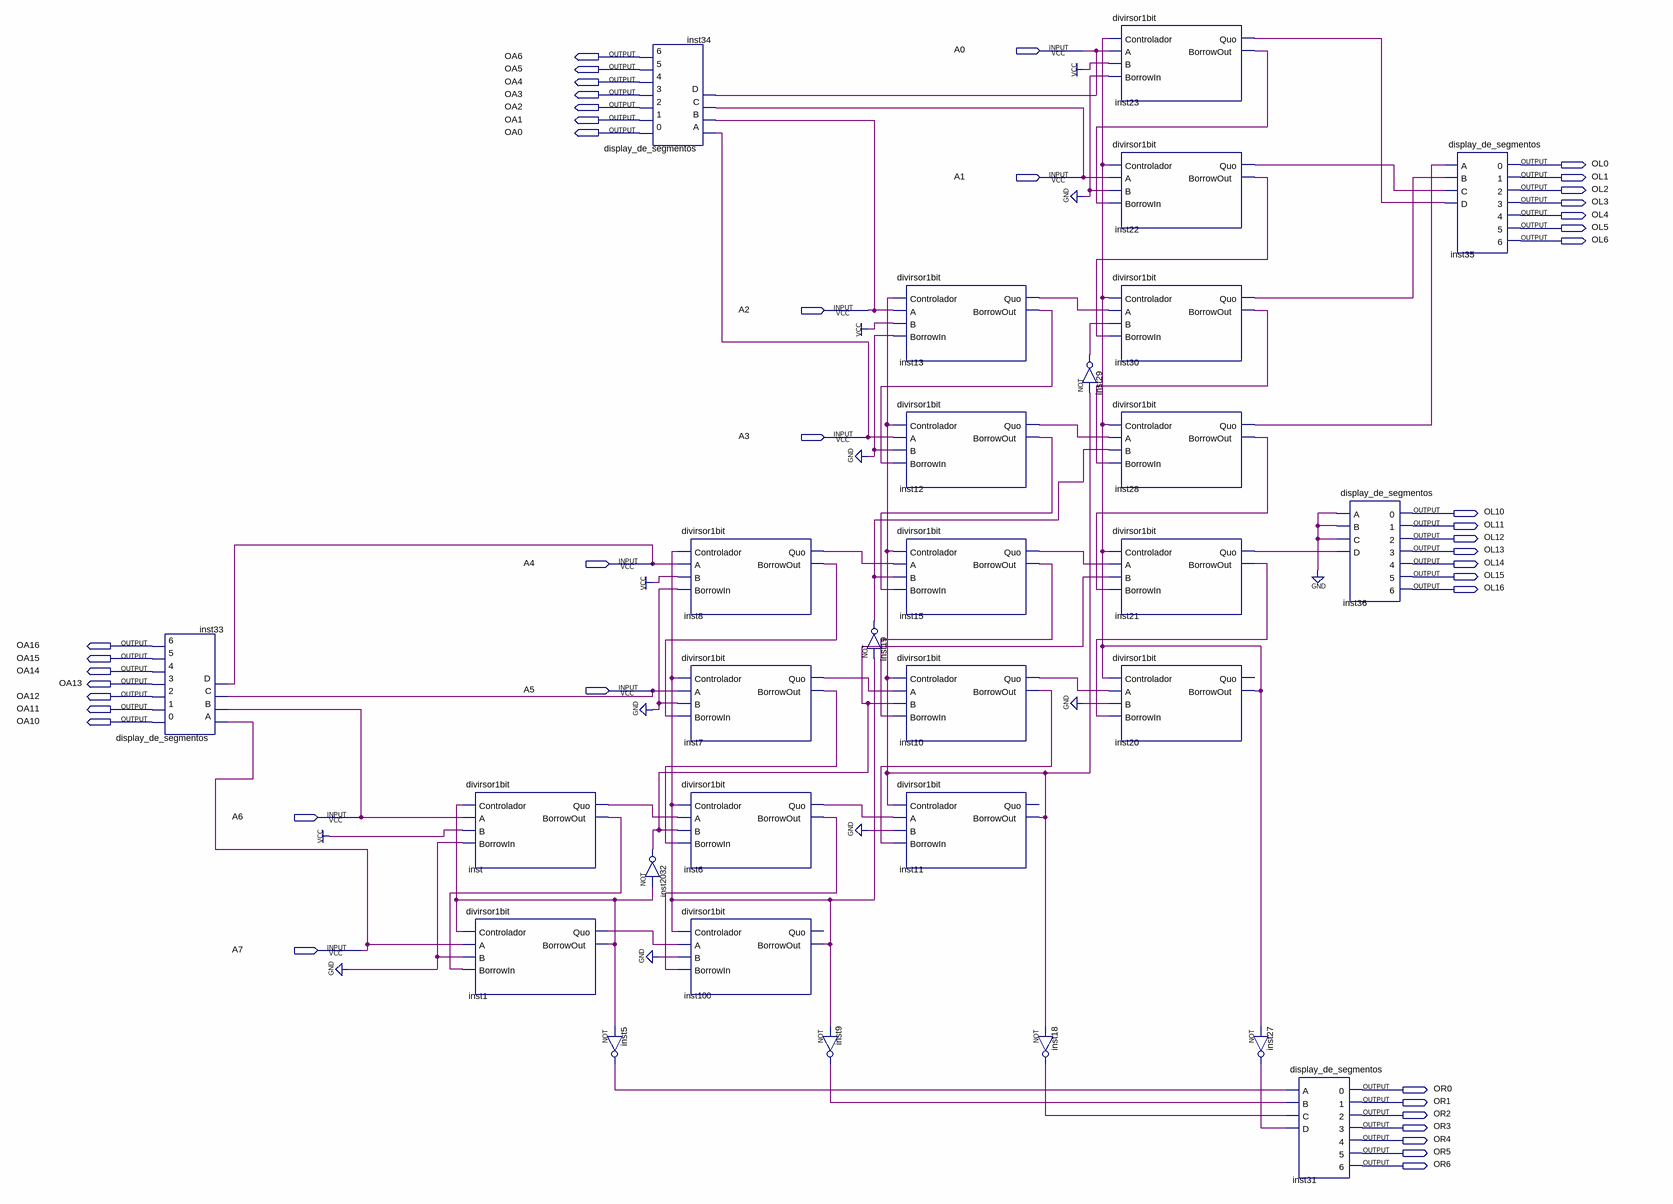
[diagram p0: schematic sheet]
// Quartus schematic raizQuadrada.bdf as structural Verilog: 29 symbols, 43 pins
module raizQuadrada (
  input  A0,
  input  A1,
  input  A2,
  input  A3,
  input  A4,
  input  A5,
  input  A6,
  input  A7,
  output OA6,
  output OA5,
  output OA4,
  output OA3,
  output OA2,
  output OA1,
  output OA0,
  output OL0,
  output OL1,
  output OL2,
  output OL3,
  output OL4,
  output OL5,
  output OL6,
  output OL10,
  output OL11,
  output OL12,
  output OL13,
  output OL14,
  output OL15,
  output OL16,
  output OA16,
  output OA15,
  output OA14,
  output OA13,
  output OA12,
  output OA11,
  output OA10,
  output OR0,
  output OR1,
  output OR2,
  output OR3,
  output OR4,
  output OR5,
  output OR6
);

  wire inst1_borrowout, inst1_quo, inst5_out, inst6_borrowout, inst6_quo, inst7_borrowout, inst7_quo,
       inst8_borrowout, inst8_quo, inst9_out, inst10_borrowout, inst10_quo, inst11_borrowout,
       inst12_borrowout, inst12_quo, inst13_borrowout, inst13_quo, inst15_borrowout, inst15_quo, inst18_out,
       inst19_out, inst20_borrowout, inst21_borrowout, inst21_quo, inst22_borrowout, inst22_quo,
       inst23_borrowout, inst23_quo, inst27_out, inst28_borrowout, inst28_quo, inst29_out, inst30_borrowout,
       inst30_quo, inst100_borrowout, inst2032_out, inst_borrowout, inst_quo;

  display_de_segmentos inst33 (
    .A(A7), .B(A6), .C(A5), .D(A4), .\0 (OA10), .\1 (OA11), .\2 (OA12), .\3 (OA13), .\4 (OA14), .\5 (OA15),
    .\6 (OA16));
  divirsor1bit inst (
    .Controlador(inst1_borrowout), .A(A6), .B(1'b1), .BorrowIn(1'b0), .Quo(inst_quo),
    .BorrowOut(inst_borrowout));
  divirsor1bit inst1 (
    .Controlador(inst1_borrowout), .A(A7), .B(1'b0), .BorrowIn(inst_borrowout), .Quo(inst1_quo),
    .BorrowOut(inst1_borrowout));
  not inst5 (inst5_out, inst1_borrowout);
  display_de_segmentos inst34 (
    .A(A3), .B(A2), .C(A1), .D(A0), .\0 (OA0), .\1 (OA1), .\2 (OA2), .\3 (OA3), .\4 (OA4), .\5 (OA5),
    .\6 (OA6));
  not inst2032 (inst2032_out, inst1_borrowout);
  divirsor1bit inst8 (
    .Controlador(inst100_borrowout), .A(A4), .B(1'b1), .BorrowIn(1'b0), .Quo(inst8_quo),
    .BorrowOut(inst8_borrowout));
  divirsor1bit inst7 (
    .Controlador(inst100_borrowout), .A(A5), .B(1'b0), .BorrowIn(inst8_borrowout), .Quo(inst7_quo),
    .BorrowOut(inst7_borrowout));
  divirsor1bit inst6 (
    .Controlador(inst100_borrowout), .A(inst_quo), .B(inst2032_out), .BorrowIn(inst7_borrowout),
    .Quo(inst6_quo), .BorrowOut(inst6_borrowout));
  divirsor1bit inst100 (
    .Controlador(inst100_borrowout), .A(inst1_quo), .B(1'b0), .BorrowIn(inst6_borrowout),
    .BorrowOut(inst100_borrowout));  // open: Quo
  not inst9 (inst9_out, inst100_borrowout);
  divirsor1bit inst13 (
    .Controlador(inst11_borrowout), .A(A2), .B(1'b1), .BorrowIn(1'b0), .Quo(inst13_quo),
    .BorrowOut(inst13_borrowout));
  divirsor1bit inst12 (
    .Controlador(inst11_borrowout), .A(A3), .B(1'b0), .BorrowIn(inst13_borrowout), .Quo(inst12_quo),
    .BorrowOut(inst12_borrowout));
  divirsor1bit inst15 (
    .Controlador(inst11_borrowout), .A(inst8_quo), .B(inst19_out), .BorrowIn(inst12_borrowout),
    .Quo(inst15_quo), .BorrowOut(inst15_borrowout));
  not inst19 (inst19_out, inst100_borrowout);
  divirsor1bit inst10 (
    .Controlador(inst11_borrowout), .A(inst7_quo), .B(inst2032_out), .BorrowIn(inst15_borrowout),
    .Quo(inst10_quo), .BorrowOut(inst10_borrowout));
  divirsor1bit inst11 (
    .Controlador(inst11_borrowout), .A(inst6_quo), .B(1'b0), .BorrowIn(inst10_borrowout),
    .BorrowOut(inst11_borrowout));  // open: Quo
  not inst18 (inst18_out, inst11_borrowout);
  divirsor1bit inst23 (
    .Controlador(inst20_borrowout), .A(A0), .B(1'b1), .BorrowIn(1'b0), .Quo(inst23_quo),
    .BorrowOut(inst23_borrowout));
  divirsor1bit inst22 (
    .Controlador(inst20_borrowout), .A(A1), .B(1'b0), .BorrowIn(inst23_borrowout), .Quo(inst22_quo),
    .BorrowOut(inst22_borrowout));
  divirsor1bit inst30 (
    .Controlador(inst20_borrowout), .A(inst13_quo), .B(inst29_out), .BorrowIn(inst22_borrowout),
    .Quo(inst30_quo), .BorrowOut(inst30_borrowout));
  not inst29 (inst29_out, inst11_borrowout);
  divirsor1bit inst28 (
    .Controlador(inst20_borrowout), .A(inst12_quo), .B(inst19_out), .BorrowIn(inst30_borrowout),
    .Quo(inst28_quo), .BorrowOut(inst28_borrowout));
  divirsor1bit inst21 (
    .Controlador(inst20_borrowout), .A(inst15_quo), .B(inst2032_out), .BorrowIn(inst28_borrowout),
    .Quo(inst21_quo), .BorrowOut(inst21_borrowout));
  divirsor1bit inst20 (
    .Controlador(inst20_borrowout), .A(inst10_quo), .B(1'b0), .BorrowIn(inst21_borrowout),
    .BorrowOut(inst20_borrowout));  // open: Quo
  not inst27 (inst27_out, inst20_borrowout);
  display_de_segmentos inst31 (
    .A(inst5_out), .B(inst9_out), .C(inst18_out), .D(inst27_out), .\0 (OR0), .\1 (OR1), .\2 (OR2), .\3 (OR3),
    .\4 (OR4), .\5 (OR5), .\6 (OR6));
  display_de_segmentos inst36 (
    .A(1'b0), .B(1'b0), .C(1'b0), .D(inst21_quo), .\0 (OL10), .\1 (OL11), .\2 (OL12), .\3 (OL13), .\4 (OL14),
    .\5 (OL15), .\6 (OL16));
  display_de_segmentos inst35 (
    .A(inst28_quo), .B(inst30_quo), .C(inst22_quo), .D(inst23_quo), .\0 (OL0), .\1 (OL1), .\2 (OL2),
    .\3 (OL3), .\4 (OL4), .\5 (OL5), .\6 (OL6));
endmodule
